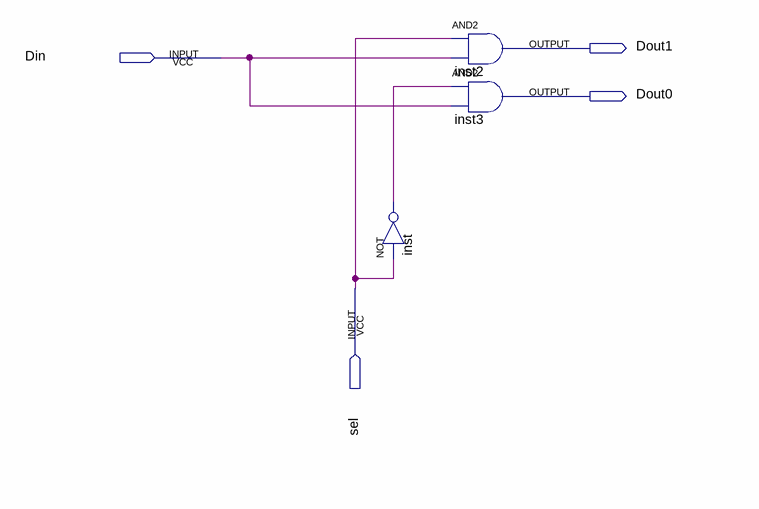
[diagram p0: schematic sheet]
// Quartus schematic DeMux1bit1x2.bdf as structural Verilog: 3 symbols, 4 pins
module DeMux1bit1x2 (
  input  Din,
  input  sel,
  output Dout1,
  output Dout0
);

  wire inst_out;

  not inst (inst_out, sel);
  and inst2 (Dout1, sel, Din);
  and inst3 (Dout0, inst_out, Din);
endmodule
